# EAGLE design placa_carol (EAGLE 9.6.2)
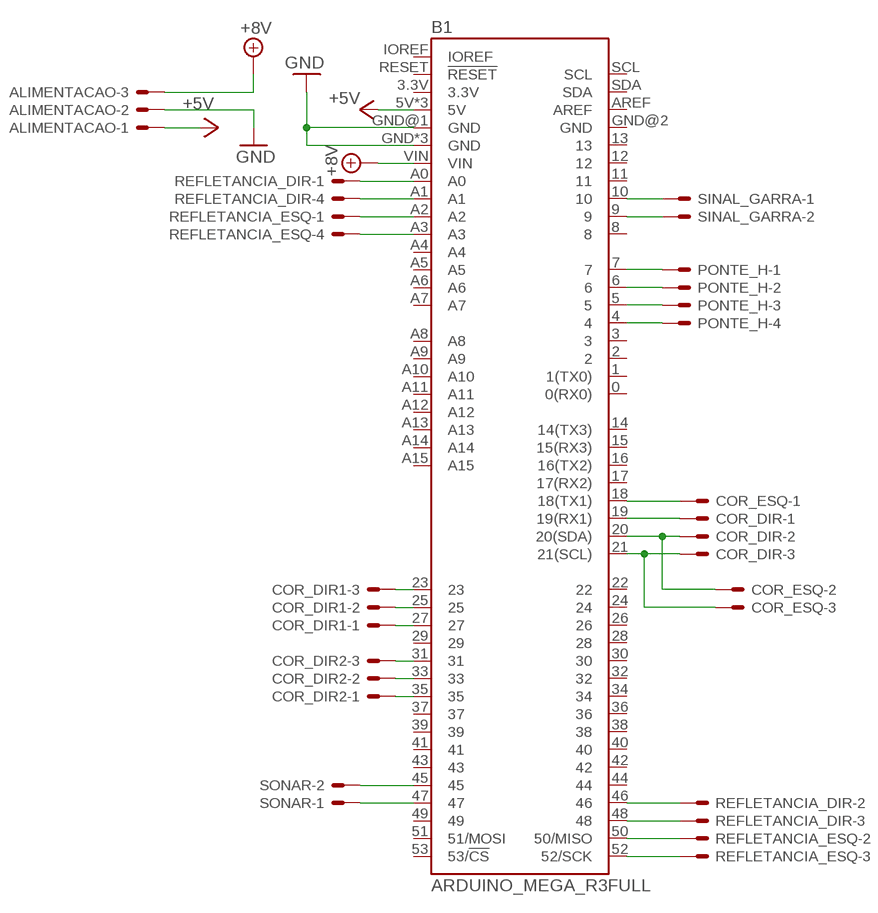
[diagram p0: schematic, sheet 1]

## Parts
ALIMENTACAO  KK-156-3  [KK-156-3]
B1  ARDUINO_MEGA_R3FULL  [ARDUINO_MEGA_NO_SILK]
COR_DIR  JST-XH-03-PIN-LONG-PAD  [JST-XH-03-PACKAGE-LONG-PAD]
COR_DIR1  JST-XH-03-PIN-LONG-PAD  [JST-XH-03-PACKAGE-LONG-PAD]
COR_DIR2  JST-XH-03-PIN-LONG-PAD  [JST-XH-03-PACKAGE-LONG-PAD]
COR_ESQ  JST-XH-03-PIN-LONG-PAD  [JST-XH-03-PACKAGE-LONG-PAD]
PONTE_H  JST-XH-04-PIN-LONG-PAD  [JST-XH-04-PACKAGE-LONG-PAD]
REFLETANCIA_DIR  JST-XH-04-PIN-LONG-PAD  [JST-XH-04-PACKAGE-LONG-PAD]
REFLETANCIA_ESQ  JST-XH-04-PIN-LONG-PAD  [JST-XH-04-PACKAGE-LONG-PAD]
SINAL_GARRA  JST-XH-02-PIN-LONG-PAD  [JST-XH-02-PACKAGE-LONG-PAD]
SONAR  JST-XH-02-PIN-LONG-PAD  [JST-XH-02-PACKAGE-LONG-PAD]

## Nets
+5V: ALIMENTACAO.1 B1.5V B1.5V@1(5V) B1.5V@2(5V)
+8V: ALIMENTACAO.3 B1.VIN
GND: ALIMENTACAO.2 B1.GND B1.GND@1(GND) B1.GND@3(GND) B1.GND@4(GND)
N$1: B1.7 PONTE_H.1
N$2: B1.6 PONTE_H.2
N$3: B1.5 PONTE_H.3
N$4: B1.4 PONTE_H.4
N$5: B1.19(19(RX1)) COR_DIR.1
N$6: B1.20(20(SDA)) COR_DIR.2 COR_ESQ.2
N$7: B1.18(18(TX1)) COR_ESQ.1
N$8: B1.45 SONAR.2
N$9: B1.21(21(SCL)) COR_DIR.3 COR_ESQ.3
N$10: B1.47 SONAR.1
N$11: B1.A0 REFLETANCIA_DIR.1
N$12: B1.A1 REFLETANCIA_DIR.4
N$13: B1.A2 REFLETANCIA_ESQ.1
N$14: B1.A3 REFLETANCIA_ESQ.4
N$15: B1.46 REFLETANCIA_DIR.2
N$16: B1.48 REFLETANCIA_DIR.3
N$17: B1.50(50/MISO) REFLETANCIA_ESQ.2
N$18: B1.52(52/SCK) REFLETANCIA_ESQ.3
N$19: B1.27 COR_DIR1.1
N$20: B1.25 COR_DIR1.2
N$21: B1.10 SINAL_GARRA.1
N$22: B1.9 SINAL_GARRA.2
N$23: B1.23 COR_DIR1.3
N$24: B1.31 COR_DIR2.3
N$25: B1.33 COR_DIR2.2
N$26: B1.35 COR_DIR2.1
Unconnected: B1.0(0(RX0)) B1.1(1(TX0)) B1.2 B1.3 B1.3.3V B1.8 B1.11 B1.12 B1.13 B1.14(14(TX3)) B1.15(15(RX3)) B1.16(16(TX2)) B1.17(17(RX2)) B1.22 B1.24 B1.26 B1.28 B1.29 B1.30 B1.32 B1.34 B1.36 B1.37 B1.38 B1.39 B1.40 B1.41 B1.42 B1.43 B1.44 B1.49 B1.51(51/MOSI) B1.53(53/!CS) B1.A4 B1.A5 B1.A6 B1.A7 B1.A8 B1.A9 B1.A10 B1.A11 B1.A12 B1.A13 B1.A14 B1.A15 B1.AREF B1.GND@2(GND) B1.IOREF B1.RESET(!RESET) B1.SCL B1.SDA

## Library data of the parts
ALIMENTACAO = con-molex:KK-156-3: KK 156 HEADER Source: http://www.molex.com/pdm_docs/sd/026604100_sd.pdf; MF: MOLEX; OC_FARNELL: unknown; OC_NEWARK: unknown
B1 = SparkFun-Boards:ARDUINO_MEGA_R3: Arduino Mega R3 ATmega2560 R3 compatible footprint. SparkFun Products: Arduino Mega 2560 R3 <https://www.sparkfun.com/products/11061>
COR_DIR COR_DIR1 COR_DIR2 COR_ESQ = Rembrandt Electronics - JST XH Connectors v1-0:JST-XH-03-PIN: JST XH Connector 2 Pin Wire to board connector. Pitch: 2,54 mm, (0.100") Number of pins: 3 Created by Rembrandt Electronics www.rembrandtelectronics.com
PONTE_H REFLETANCIA_DIR REFLETANCIA_ESQ = Rembrandt Electronics - JST XH Connectors v1-0:JST-XH-04-PIN: JST XH Connector 2 Pin Wire to board connector. Pitch: 2,54 mm, (0.100") Number of pins: 4 Created by Rembrandt Electronics www.rembrandtelectronics.com
SINAL_GARRA SONAR = Rembrandt Electronics - JST XH Connectors v1-0:JST-XH-02-PIN: JST XH Connector 2 Pin Wire to board connector. Pitch: 2,54 mm, (0.100") Number of pins: 2 Created by Rembrandt Electronics www.rembrandtelectronics.com

## Board
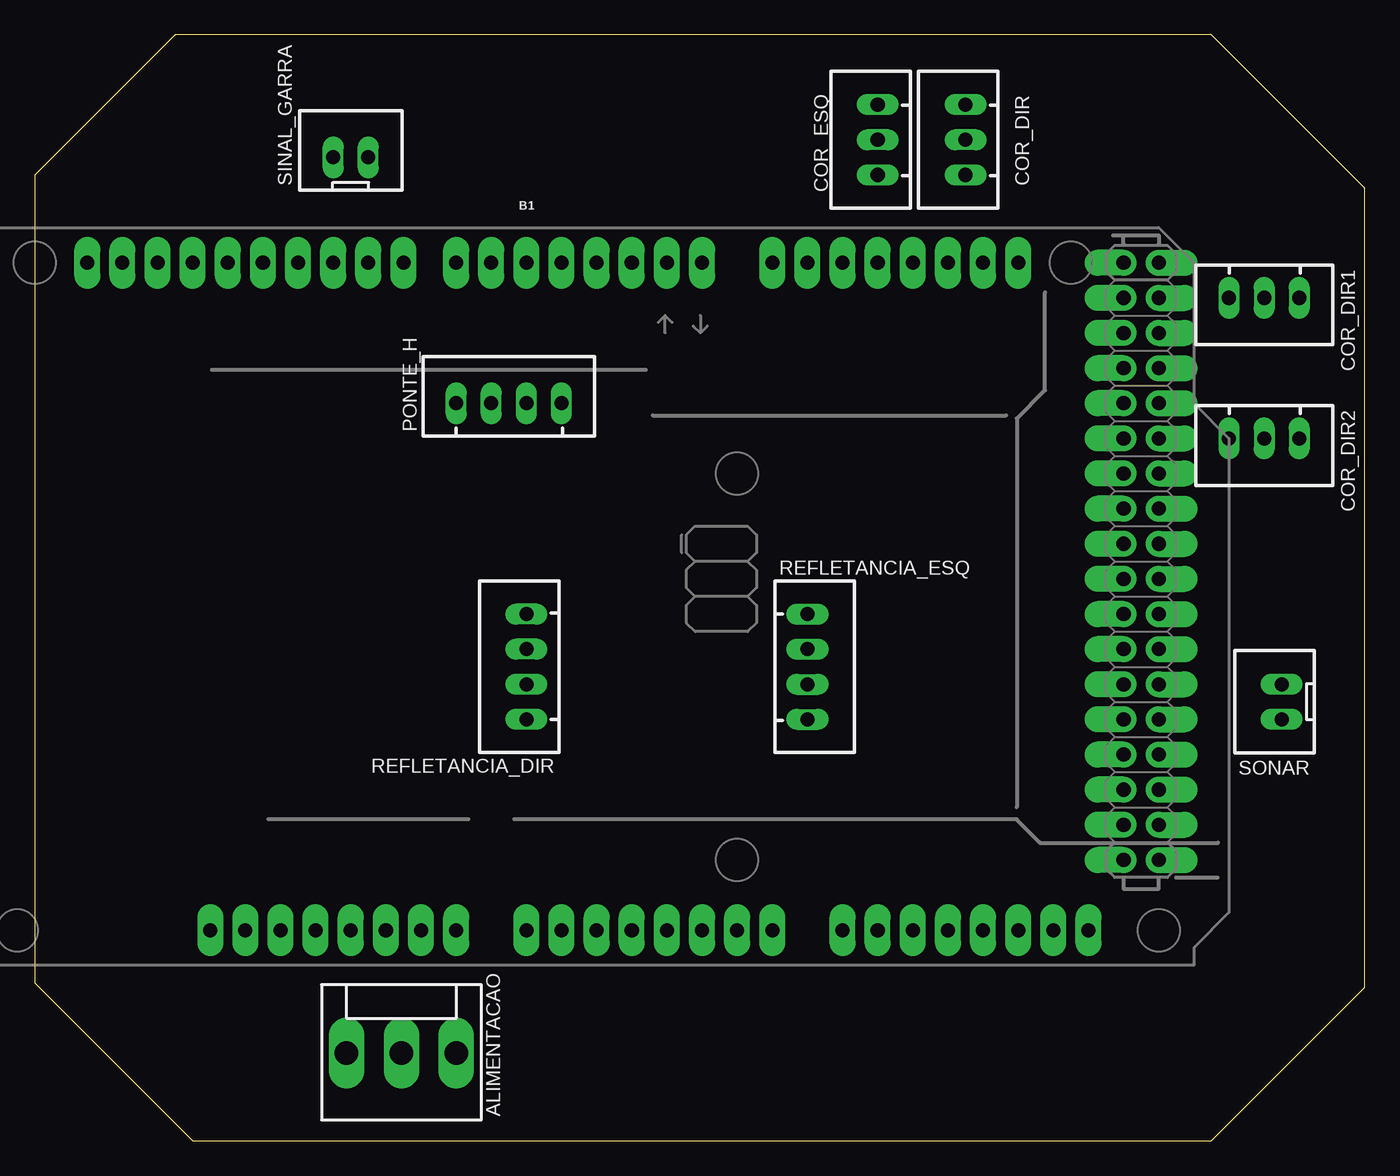
[diagram p1: board, top side]
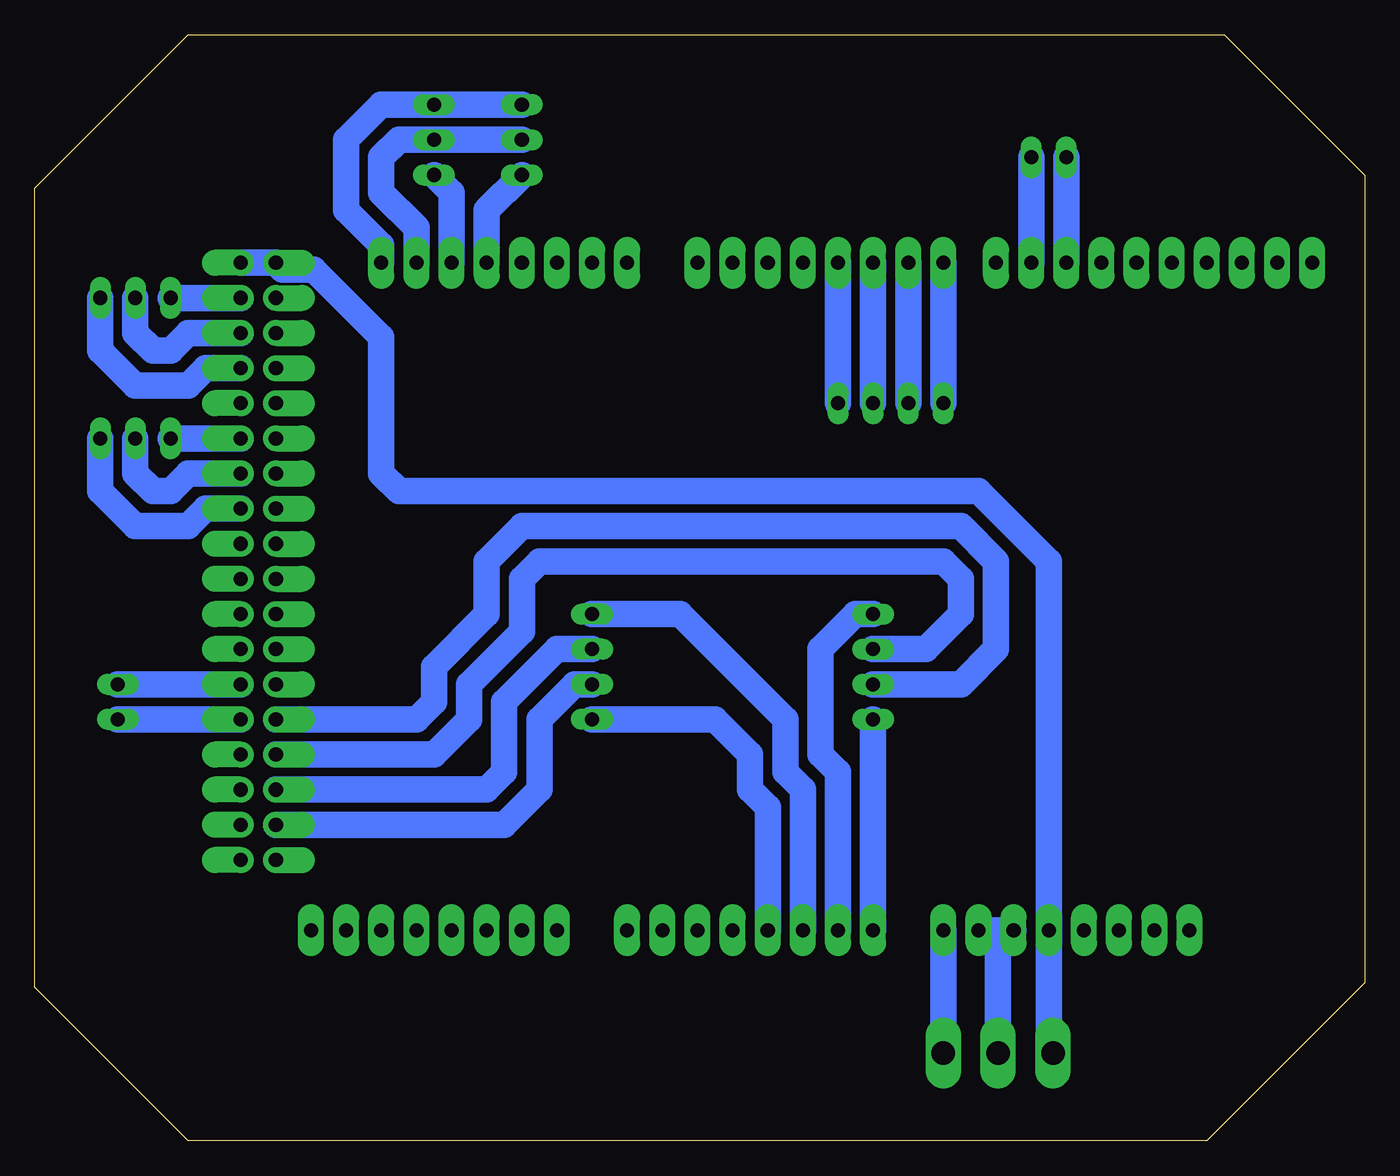
[diagram p2: board, bottom side, seen from below]

Size 96.19 x 80 mm. Coordinates in mm from the lower left corner, seen from the top.
Outline: 0,69.85 0,11.43 11.43,0 85.09,0 96.19,11.1 96.19,68.91 85.1,80 10.15,80 0,69.85
Copper layers (1*16): Top 0.035mm / dielectric 1.5mm / Bottom 0.035mm
Design rules "default": minimum track width 6mil, minimum drill 0.35mm, track to track 6mil, track to pad 6mil, pad to pad 6mil, via to via 6mil, smd to smd 6mil, copper to edge 40mil, drill to drill 6mil, minimum pad ring 10mil, minimum via ring 8mil, stop-mask expansion 4mil, vias tented up to drill 0mil, thermal gap 10mil

### Footprints (pad centres in the part's own frame; a part is rotated, then mirrored left to right if it is on the bottom)
KK-156-3 = drill 1.7 pad 2.184 long: 1 -3.96,0; 2 0,0; 3 3.96,0
ARDUINO_MEGA_NO_SILK = drill 1.016 pad 1.88 long: 0 13.97,24.13; 1 11.43,24.13; 2 8.89,24.13; 3 6.35,24.13; 3.3V -13.97,-24.13; 4 3.81,24.13; 5 1.27,24.13; 5V -11.43,-24.13; 6 -1.27,24.13; 7 -3.81,24.13; 8 -7.62,24.13; 9 -10.16,24.13; 10 -12.7,24.13; 11 -15.24,24.13; 12 -17.78,24.13; 13 -20.32,24.13; 14 19.05,24.13; 15 21.59,24.13; 16 24.13,24.13; 17 26.67,24.13; 18 29.21,24.13; 19 31.75,24.13; 20 34.29,24.13; 21 36.83,24.13; A0 1.27,-24.13; A1 3.81,-24.13; A2 6.35,-24.13; A3 8.89,-24.13; A4 11.43,-24.13; A5 13.97,-24.13; A6 16.51,-24.13; A7 19.05,-24.13; A8 24.13,-24.13; A9 26.67,-24.13; A10 29.21,-24.13; A11 31.75,-24.13; A12 34.29,-24.13; A13 36.83,-24.13; A14 39.37,-24.13; A15 41.91,-24.13; AREF -25.4,24.13; GND -8.89,-24.13; GND@1 -6.35,-24.13; GND@4 -22.86,24.13; IOREF -19.05,-24.13; NC -21.59,-24.13; RESET -16.51,-24.13; SCL -30.48,24.13; SDA -27.94,24.13; VIN -3.81,-24.13 | drill 1.016 pad 1.88 offset: 5V@1 44.45,24.13; 5V@2 46.99,24.13; 22 44.45,21.59; 23 46.99,21.59; 24 44.45,19.05; 25 46.99,19.05; 26 44.45,16.51; 27 46.99,16.51; 28 44.45,13.97; 29 46.99,13.97; 30 44.45,11.43; 31 46.99,11.43; 32 44.45,8.89; 33 46.99,8.89; 34 44.45,6.35; 35 46.99,6.35; 36 44.45,3.81; 37 46.99,3.81; 38 44.45,1.27; 39 46.99,1.27; 40 44.45,-1.27; 41 46.99,-1.27; 42 44.45,-3.81; 43 46.99,-3.81; 44 44.45,-6.35; 45 46.99,-6.35; 46 44.45,-8.89; 47 46.99,-8.89; 48 44.45,-11.43; 49 46.99,-11.43; 50 44.45,-13.97; 51 46.99,-13.97; 52 44.45,-16.51; 53 46.99,-16.51; GND@2 44.45,-19.05; GND@3 46.99,-19.05
JST-XH-03-PACKAGE-LONG-PAD = drill 1.016 long: 1 -2.54,0; 2 0,0; 3 2.54,0
JST-XH-04-PACKAGE-LONG-PAD = drill 1.016 long: 1 -3.81,0; 2 -1.27,0; 3 1.27,0; 4 3.81,0
JST-XH-02-PACKAGE-LONG-PAD = drill 1.016 long: 1 -1.27,0; 2 1.27,0

### Placement (x,y rotation side)
ALIMENTACAO  26.52,6.35 0 top
B1  34.29,39.37 0 top
COR_DIR  67.31,72.39 90 top
COR_DIR1  88.9,60.96 180 top
COR_DIR2  88.9,50.8 180 top
COR_ESQ  60.96,72.39 90 top
PONTE_H  34.29,53.34 0 top
REFLETANCIA_DIR  35.56,34.29 90 top
REFLETANCIA_ESQ  55.88,34.29 270 top
SINAL_GARRA  22.86,71.12 0 top
SONAR  90.17,31.75 90 top

### Tracks (layer width: path | path; a pad name or v marks a point on that pad's centre or on a via)
+5V
  Bottom 1.9: ALIMENTACAO.1 22.86,6.65 B1.5V 22.86,41.91 27.94,46.99 69.85,46.99 71.12,48.26 71.12,58.11 76.01,63 78.24,63 B1.5V@1 B1.5V@2
+8V
  Bottom 1.9: B1.VIN ALIMENTACAO.3
GND
  Bottom 1.9: B1.GND 26.67,15.24 | 26.67,15.24 B1.GND@1 | ALIMENTACAO.2 26.52,15.09 26.67,15.24
N$1
  Bottom 1.9: B1.7 PONTE_H.1
N$2
  Bottom 1.9: B1.6 PONTE_H.2
N$3
  Bottom 1.9: B1.5 PONTE_H.3
N$4
  Bottom 1.9: PONTE_H.4 B1.4
N$5
  Bottom 1.9: COR_DIR.1 66.04,68.58 B1.19
N$6
  Bottom 1.9: COR_ESQ.2 COR_DIR.2 69.85,72.39 71.12,71.12 71.12,68.58 68.58,66.04 B1.20
N$7
  Bottom 1.9: COR_ESQ.1 63.5,67.31 B1.18
N$8
  Bottom 1.9: B1.45 SONAR.2
N$9
  Bottom 1.9: B1.21 71.12,64.77 73.66,67.31 73.66,72.39 71.12,74.93 COR_DIR.3 COR_ESQ.3
N$10
  Bottom 1.9: B1.47 SONAR.1
N$11
  Bottom 1.9: REFLETANCIA_DIR.1 B1.A0
N$12
  Bottom 1.9: B1.A1 38.1,26.67 39.37,27.94 39.37,35.56 36.83,38.1 REFLETANCIA_DIR.4
N$13
  Bottom 1.9: B1.A2 40.64,25.4 41.91,26.67 41.91,30.48 49.53,38.1 REFLETANCIA_ESQ.1
N$14
  Bottom 1.9: B1.A3 43.18,24.13 44.45,25.4 44.45,27.94 46.99,30.48 REFLETANCIA_ESQ.4
N$15
  Bottom 1.9: B1.46 68.58,30.48 67.31,31.75 67.31,34.29 63.5,38.1 63.5,41.91 60.96,44.45 29.21,44.45 26.67,41.91 26.67,35.56 29.21,33.02 REFLETANCIA_DIR.2
N$16
  Bottom 1.9: B1.48 67.31,27.94 64.77,30.48 64.77,33.02 60.96,36.83 60.96,40.64 59.69,41.91 30.48,41.91 29.21,40.64 29.21,38.1 31.75,35.56 REFLETANCIA_DIR.3
N$17
  Bottom 1.9: REFLETANCIA_ESQ.2 58.42,35.56 62.23,31.75 62.23,26.67 63.5,25.4 B1.50
N$18
  Bottom 1.9: REFLETANCIA_ESQ.3 57.15,33.02 59.69,30.48 59.69,25.4 62.23,22.86 B1.52
N$19
  Bottom 1.9: B1.27 83.82,55.88 85.09,54.61 88.9,54.61 91.44,57.15 COR_DIR1.1
N$20
  Bottom 1.9: B1.25 85.09,58.42 86.36,57.15 87.63,57.15 88.9,58.42 COR_DIR1.2
N$21
  Bottom 1.9: SINAL_GARRA.1 B1.10
N$22
  Bottom 1.9: SINAL_GARRA.2 B1.9
N$23
  Bottom 1.9: B1.23 COR_DIR1.3
N$24
  Bottom 1.9: B1.31 COR_DIR2.3
N$25
  Bottom 1.9: B1.33 85.09,48.26 86.36,46.99 87.63,46.99 88.9,48.26 COR_DIR2.2
N$26
  Bottom 1.9: B1.35 83.82,45.72 85.09,44.45 88.9,44.45 91.44,46.99 COR_DIR2.1